# EAGLE design source_eagle (EAGLE 9.6.2)
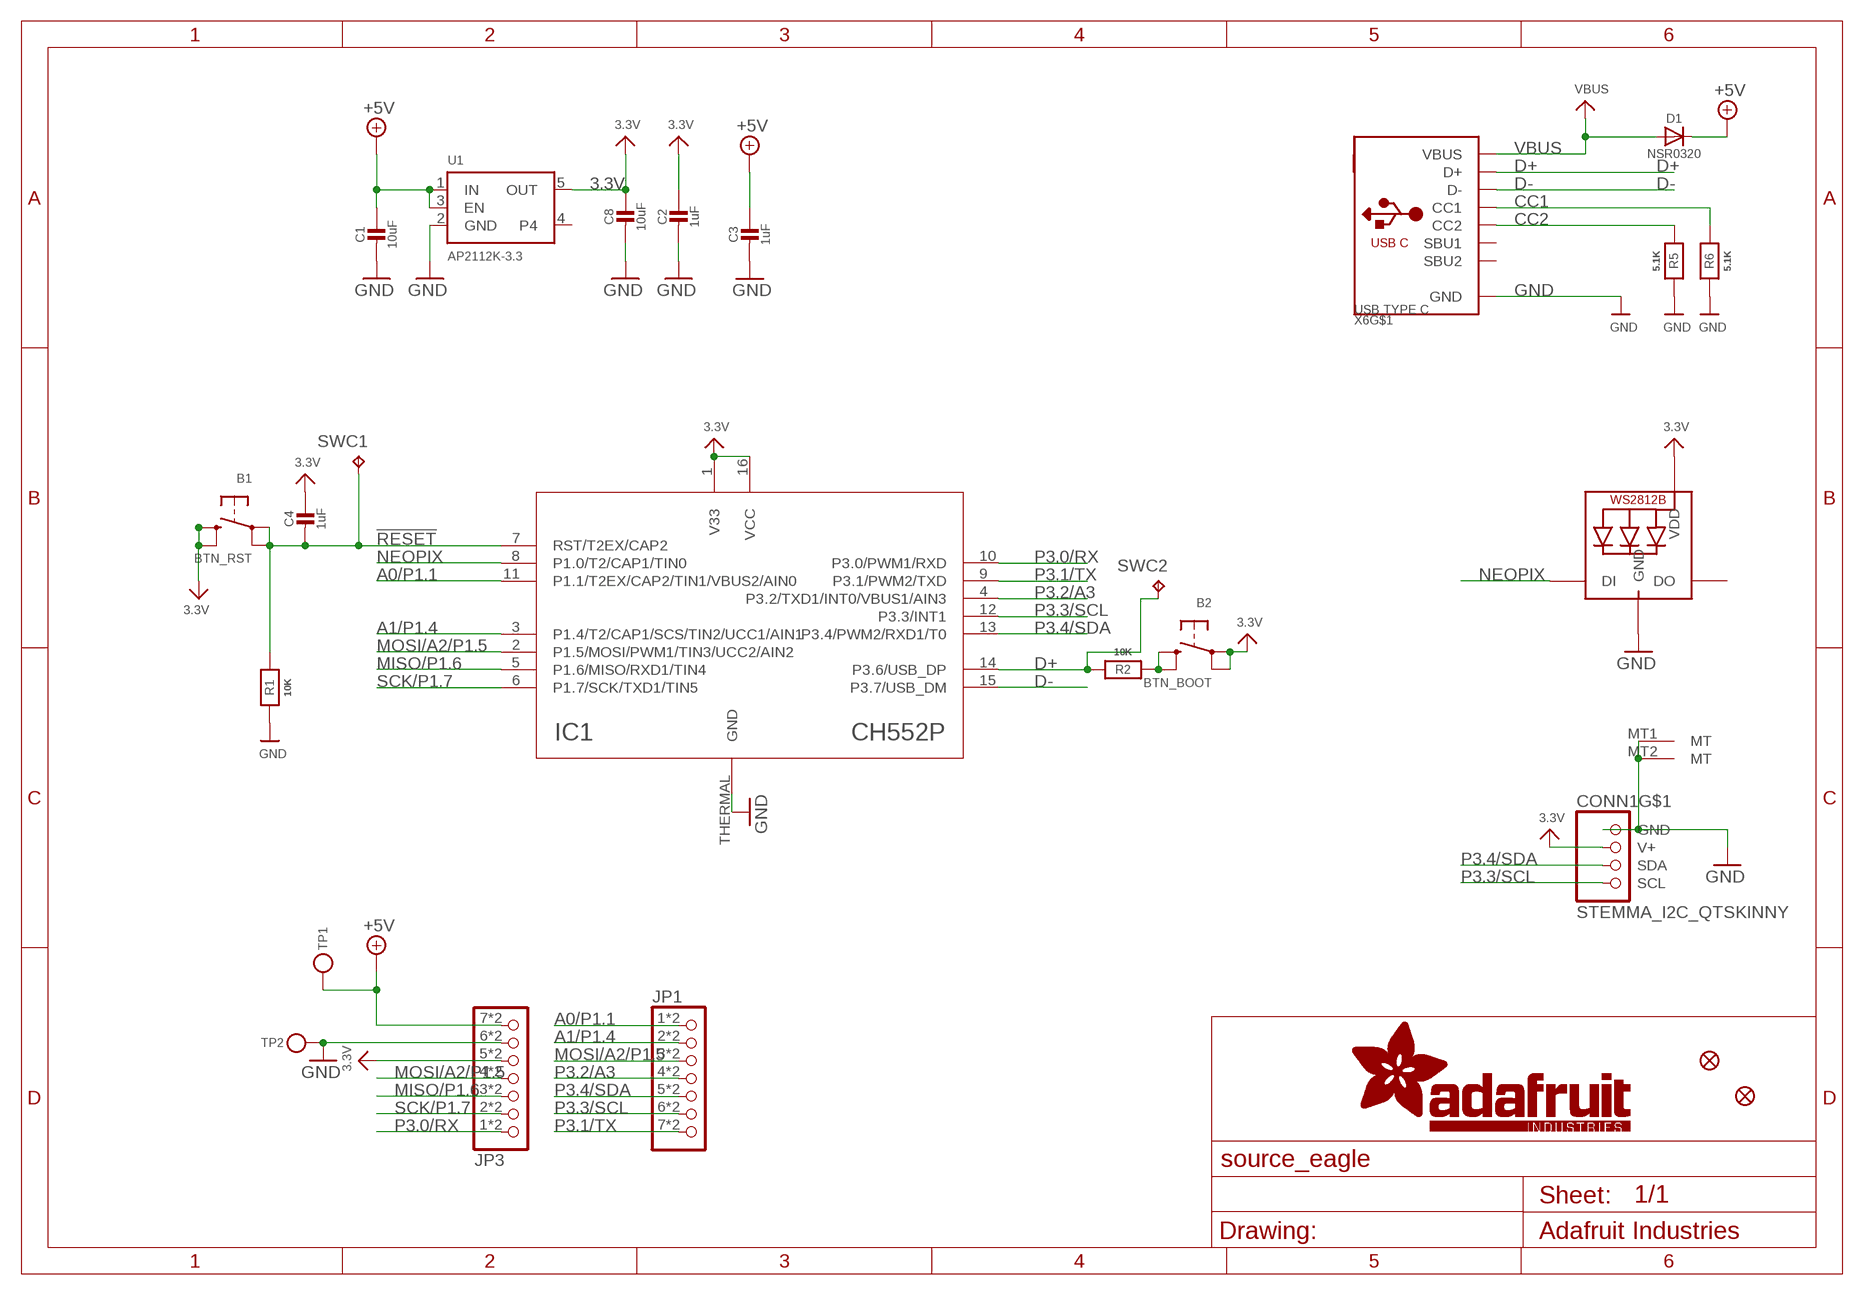
[diagram p0: schematic, sheet 1]

## Parts
B1  BTN_RST  SWITCH_TACT_SMT_RKB2  [BTN_RKB2_4.6X2.8]
B2  BTN_BOOT  SWITCH_TACT_SMT_RKB2  [BTN_RKB2_4.6X2.8]
C1  10uF  CAP_CERAMIC_0805MP  [_0805MP]
C2  1uF  CAP_CERAMIC_0402NO  [_0402NO]
C3  1uF  CAP_CERAMIC_0402NO  [_0402NO]
C4  1uF  CAP_CERAMIC_0402NO  [_0402NO]
C8  10uF  CAP_CERAMIC_0805MP  [_0805MP]
CONN1  STEMMA_I2C_QTSKINNY  [JST_SH4_SKINNY]
D1  NSR0320  DIODE_SOD323MINI  [SOD-323_MINI]
IC1  CH552PP  [QFN16_3MM]
JP1  HEADER-1X7_CASTEL  [1X07_CASTEL]
JP3  HEADER-1X7_CASTEL  [1X07_CASTEL]
LED1  WS2812B_SK6805_1515  [SK6805_1515]
R1  10K  RESISTOR_0402NO  [_0402NO]
R2  10K  RESISTOR_0402NO  [_0402NO]
R5  5.1K  RESISTOR_0402NO  [_0402NO]
R6  5.1K  RESISTOR_0402NO  [_0402NO]
SWC1  TPB1,27  [B1,27]
SWC2  TPTP15R  [TP15R]
TP1  TESTPOINT_PLUS13  [TESTPOINT_PLUS_1X3MM]
TP2  TESTPOINT_MINUS  [TESTPOINT_MINUS_1X3MM]
U1  AP2112K-3.3  VREG_SOT23-5  [SOT23-5]
U$6  FIDUCIAL_1MM  [FIDUCIAL_1MM]
U$8  FIDUCIAL_1MM  [FIDUCIAL_1MM]
X6  USB TYPE C  USB_C  [USB_C_CUSB31-CFM2AX-01-X]

## Nets
3.3V [power]: B1.B'(S1) B1.B(S) B2.A'(P1) B2.A(P) C2.1 C4.1 C8.1 CONN1.2(V+) IC1.1(V33) IC1.16(VCC) JP3.5 JP3.5C LED1.2(VDD) U1.5(OUT)
!RESET: B1.A'(P1) B1.A(P) C4.2 IC1.7(RST/T2EX/CAP2) R1.2 SWC1.TP
+5V [power]: C1.1 C3.1 D1.C JP3.7 JP3.7C TP1.P$1 U1.1(IN) U1.3(EN)
A0/P1.1: IC1.11(P1.1/T2EX/CAP2/TIN1/VBUS2/AIN0) JP1.1 JP1.1C
A1/P1.4: IC1.3(P1.4/T2/CAP1/SCS/TIN2/UCC1/AIN1) JP1.2 JP1.2C
CC1: R6.2 X6.A5(CC1)
CC2: R5.2 X6.B5(CC2)
D+: IC1.14(P3.6/USB_DP) R2.2 SWC2.TP X6.A6(D+) X6.B6(D+)
D-: IC1.15(P3.7/USB_DM) X6.A7(D-) X6.B7(D-)
GND [power]: C1.2 C2.2 C3.2 C8.2 CONN1.1(GND) CONN1.MT1(MT) CONN1.MT2(MT) IC1.THERMAL(GND) JP3.6 JP3.6C LED1.4(GND) R1.1 R5.1 R6.1 TP2.P$1 U1.2(GND) X6.A1B12(GND) X6.B1A12(GND)
MISO/P1.6: IC1.5(P1.6/MISO/RXD1/TIN4) JP3.3 JP3.3C
MOSI/A2/P1.5: IC1.2(P1.5/MOSI/PWM1/TIN3/UCC2/AIN2) JP1.3 JP1.3C JP3.4 JP3.4C
N$1: B2.B'(S1) B2.B(S) R2.1
NEOPIX: IC1.8(P1.0/T2/CAP1/TIN0) LED1.1(DI)
P3.0/RX: IC1.10(P3.0/PWM1/RXD) JP3.1 JP3.1C
P3.1/TX: IC1.9(P3.1/PWM2/TXD) JP1.7 JP1.7C
P3.2/A3: IC1.4(P3.2/TXD1/INT0/VBUS1/AIN3) JP1.4 JP1.4C
P3.3/SCL: CONN1.4(SCL) IC1.12(P3.3/INT1) JP1.6 JP1.6C
P3.4/SDA: CONN1.3(SDA) IC1.13(P3.4/PWM2/RXD1/T0) JP1.5 JP1.5C
SCK/P1.7: IC1.6(P1.7/SCK/TXD1/TIN5) JP3.2 JP3.2C
VBUS [power]: D1.A X6.A4B9(VBUS) X6.B4A9(VBUS)
Unconnected: LED1.3(DO) U1.4 X6.A8(SBU1) X6.B8(SBU2) X6.M1(MT) X6.M2(MT) X6.M3(MT) X6.M4(MT)

## Library data of the parts
B1 B2 = adafruit_electromech:SWITCH_TACT_SMT: SMT Tact Switches RKB2 https://www.digikey.com/short/m027prz5
C1-C4 C8 = microbuilder:CAP_CERAMIC: Ceramic Capacitors For new designs, use the packages preceded by an '_' character since they are more reliable: The following footprints should be used on most boards: _0402 - Standard footprint for regular board layouts _0603 - Standard footprint for regular board layouts _0805 - Standard footprint for regular board layouts _1206 - Standard footprint for regular board layouts For extremely tight-pitch boards where space is at a premium, the following 'micro-pitch' footprints can be used (smaller pads, no silkscreen outline, etc.): _0402MP - Micro-pitch footprint for very dense/compact boards _0603MP - Micro-pitch footprint for very dense/compact boards _0805MP - Micro-pitch footprint for very dense/compact boards _1206MP - Micro-pitch footprint for very dense/compact boards
CONN1 = microbuilder:STEMMA_I2C
D1 = microbuilder:DIODE: Diode SMA Model Volts Amps Type Vf Ir Digikey # Notes SSA34-E3 40V 3A Schottky 480mV @ 3A 200uA @ 40V SSA34-E3/61TGITR-ND CDBA120-G 20V 1A Schottky 500mV @ 1A 500uA @ 20V 641-1014-6-ND REEL MBRA210 10V 2A Schottky 350mV @ 2A 700uA @ 10V MBRA210LT3 SOD-123 Model Volts Amps Type Vf Ir Order # Notes BAT54T1G 30V 200mA Schottky 800mV @ 200mA 2uA @ 25V BAT54T1GOSTR-ND B0530W 30V 500mA Schottky 430mV @ 500mA 130uA @ 30V B0530W-FDICT-ND REEL MBR120 20V 1A Schottky 340mV @ 1A MBR120VLSFT1GOSCT-ND SOD-323 Model Volts Amps Type Vf Ir Order # Notes PMEG2005EJ 20V 500mA Schottky 355mV @ 500mA 568-4110-1-ND ZLLS410 10V 570mA Schottky 380mV @ 570mA ZLLS410CT-ND 1N4148WS 75V 150mA Silicon/Simple 1V 1N4148WSFSCT-ND REEL SOD-523 Model Volts Amps Type Vf Ir Order # Notes BAT54XV2 30V 200mA Schottky 0.8V @ 100mA BAT54XV2CT-ND TB751S 30V 30mA Schottky RB751S-40TE61CT-ND SOT23-R/W (R = Solder Paste/Reflow Ovens, W = Hand-Soldering) Model Volts Amps Type Vf Ir Order # Notes BAT54FILM 40V 300mA Schottky 497-7162-1-ND POWERDI-5 Model Volts Amps Type Vf Ir Order # Notes PDS560 60V 5A Schottky 670mV @ 5A 150uA @ 60V PDS560DICT-ND
IC1 = adafruit_micro:CH552P
JP1 JP3 = microbuilder:HEADER-1X7: PIN HEADER
LED1 = microbuilder:WS2812B; LCSC: C2890035
R1 R2 R5 R6 = microbuilder:RESISTOR: Resistors For new designs, use the packages preceded by an '_' character since they are more reliable: The following footprints should be used on most boards: _0402 - Standard footprint for regular board layouts _0603 - Standard footprint for regular board layouts _0805 - Standard footprint for regular board layouts _1206 - Standard footprint for regular board layouts For extremely tight-pitch boards where space is at a premium, the following 'micro-pitch' footprints can be used (smaller pads, no silkscreen outline, etc.): _0402MP - Micro-pitch footprint for very dense/compact boards _0603MP - Micro-pitch footprint for very dense/compact boards _0805MP - Micro-pitch footprint for very dense/compact boards _1206MP - Micro-pitch footprint for very dense/compact boards
SWC1 SWC2 = testpad:TP: Test pad
TP1 TP2 = microbuilder:TESTPOINT: Test Point Various test points for characterisation and PCB testing TESTPOINT_SMT - Compact Surface Mount Test Point [Digikey: 5016KTR-ND]
U1 = adafruit_power:VREG_SOT23-5: SOT23-5 Fixed Voltage Regulators Part Current Out V Out V In V Dropout θJA (°C/W) TJ (°C) Digikey Part No. ADP121 150mA 3.3V 3.4-5.5V 0.09V @ 150mA -- -- ADP121-AUJZ33R7CT-ND ADP121 150mA 3.0V 3.1-5.5V 0.09V @ 150mA -- -- ADP121-AUJZ30R7CT-ND ADP122 300mA 3.3V 3.4-5.5V 0.085V @ 300mA -- -- ADP122AUJZ-3.3-R7CT-ND ADP1712 300mA 3.3V 3.5-5.5V 0.17V @ 300mA -- -- ADP1712AUJZ-3.3-R7TR-ND AP7311 (Low Cost) 150mA 3.3V 3.5-6V 0.15V @ 150mA -- -- AP7311-33WG-7DICT-ND LD39015M18R 150mA 1.8V 1.9V-5.5V 0.08V @ 100mA -- -- 497-6977-1-ND LP2985A-33DBVR 150mA 3.3V 3.3-16V 0.28V @ 150mA 206 150 296-18479-1-ND MCP1824T-3302E/OT 300mA 3.3V 3.5V-6V 0.2V @ 300mA -- -- MCP1824T-3302E/OTCT-ND MIC5205-2.5YM5 TR 150mA 2.5V 2.7-16V 0.165V @ 150mA -- -- 576-1257-2-ND MIC5205-3.0YM5 TR 150mA 3.0V 3.2V-16V 0.165V @ 150mA -- -- 576-1258-2-ND MIC5205-3.3YM5 TR 150mA 3.3V 3.5V-16V 0.165V @ 150mA -- -- 576-1259-2-ND TPS780330220 150mA 3.3V+2.2V 3.6-5.5V 250mV Max -- -- 296-23332-1-ND TDA3663/N1,135 100mA 3.3V 3.5-45V 0.18V @ 50mA -- -- 568-5343-1-ND Max operating temp can be calculated using θJA, TJ (max junction temperature), and power in watts. Set the "Maximum Ambient Temperature" until it reaches TJ ("Max Junction Temperature"), which is the absolute limit for safe use of the regulator: Heat Sink Temperature Calculator <http://www.daycounter.com/Calculators/Heat-Sink-Temperature-Calculator.phtml> For example, With 12V source into a 3.3V LP2985 and a 30mA load, we are dissipating (12V-3.3V) * 0.03A = 0.261W. With a θJA of 206 °C/W, a TJ of 150°C, and 261mW we can safely use the chip without a heat sink up to 75°C (=147.1°C Junction Temperature).; JLC_ROTATION: 270
U$6 U$8 = microbuilder:FIDUCIAL: Fiducial Alignment Points Various fiducial points for machine vision alignment.; BOM: EXCLUDE
X6 = adafruit_electromech:USB_C: USB Type-C USB 2.0 Connector; LCSC: C165948

## Net classes
1 power: width 0.254 mm
2 gnd: width 0.254 mm

## Board
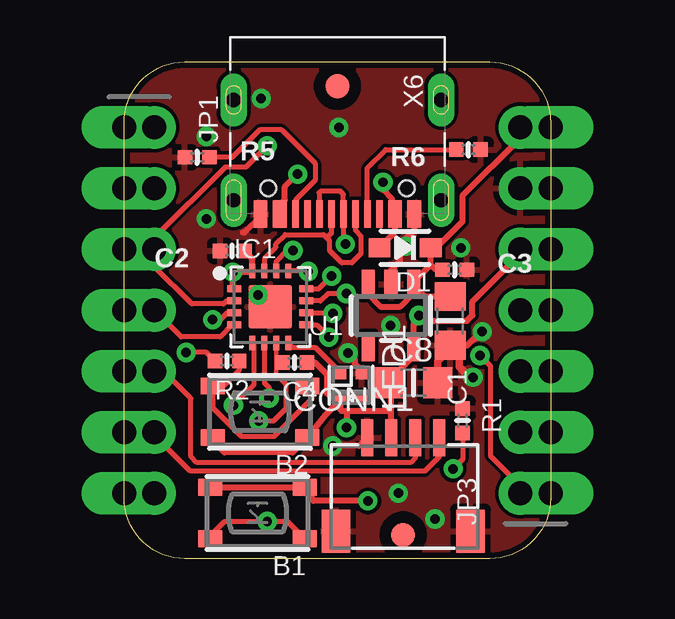
[diagram p1: board, top side]
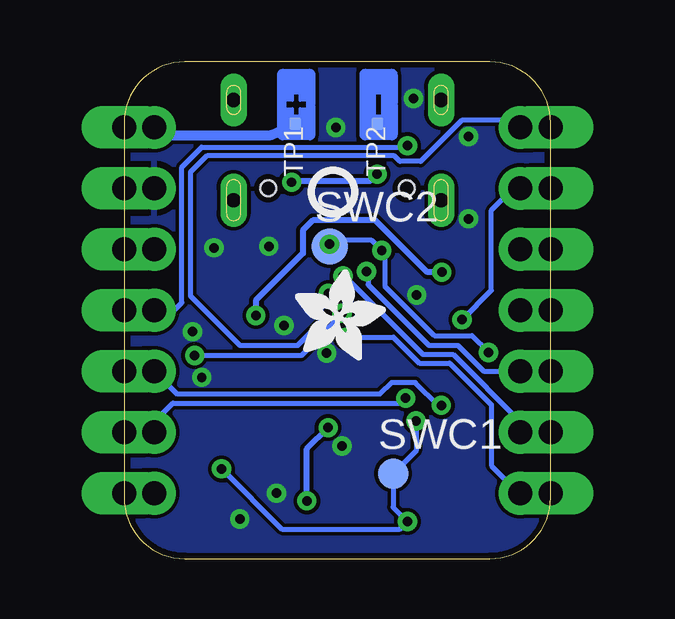
[diagram p2: board, bottom side, seen from below]

Size 17.78 x 20.7 mm. Coordinates in mm from the lower left corner, seen from the top.
Outline: 17.78,18.16 17.78,2.54 arc-90 15.24,0 2.54,0 arc-90 0,2.54 0,18.16 arc-90 2.54,20.7 15.24,20.7 arc-90 17.78,18.16
Copper layers (1*16): Top 0.035mm / dielectric 1.5mm / Bottom 0.035mm
Design rules "adafruit 6-6": minimum track width 6mil, minimum drill 15.5mil, track to track 6mil, track to pad 6mil, pad to pad 6mil, via to via 6mil, smd to smd 6mil, copper to edge 10mil, drill to drill 8mil, minimum pad ring 10mil, minimum via ring 8mil, stop-mask expansion 2mil, vias tented up to drill 20mil, thermal gap 10mil

### Footprints (pad centres in the part's own frame; a part is rotated, then mirrored left to right if it is on the bottom)
BTN_RKB2_4.6X2.8 = smd 1 x 0.7: A 1.973,1.075; A' -1.973,1.075; B 1.973,-1.075; B' -1.973,-1.075
_0805MP = smd 1.2 x 1.3: 1 -1.016,0; 2 1.016,0
_0402NO = smd 0.6 x 0.6: 1 -0.508,0; 2 0.508,0
JST_SH4_SKINNY = smd 0.5 x 1.55: 1 -1.5,2.514; 2 -0.5,2.514; 3 0.5,2.514; 4 1.5,2.514 | smd 1.2 x 1.8: MT1 -2.8,-1.386; MT2 2.8,-1.386
SOD-323_MINI = smd 0.9 x 0.8: A 1.07,0; C -1.07,0
QFN16_3MM = smd 0.6 x 0.28: 1 -1.5,0.75; 2 -1.5,0.25; 3 -1.5,-0.25; 4 -1.5,-0.75; 9 1.5,-0.75; 10 1.5,-0.25; 11 1.5,0.25; 12 1.5,0.75 | smd 0.28 x 0.6: 5 -0.75,-1.5; 6 -0.25,-1.5; 7 0.25,-1.5; 8 0.75,-1.5; 13 0.75,1.5; 14 0.25,1.5; 15 -0.25,1.5; 16 -0.75,1.5 | smd 1.8 x 1.8: THERMAL 0,0
1X07_CASTEL = drill 1 pad 1.778: 1 -7.62,0; 2 -5.08,0; 3 -2.54,0; 4 0,0; 5 2.54,0; 6 5.08,0; 7 7.62,0 | drill 1 pad 1.778 long: 1C -7.62,-1.27; 2C -5.08,-1.27; 3C -2.54,-1.27; 4C 0,-1.27; 5C 2.54,-1.27; 6C 5.08,-1.27; 7C 7.62,-1.27
SK6805_1515 = smd 0.5 x 0.5: 1 -0.5,-0.45; 2 0.5,-0.45; 3 0.5,0.45; 4 -0.5,0.45
B1,27 = smd 1.27 x 1.27: TP 0,0
TP15R = smd 1.5 x 1.5: TP 0,0
TESTPOINT_PLUS_1X3MM = smd 0.5 x 0.5: P$1 0.8,-0.05
TESTPOINT_MINUS_1X3MM = smd 0.5 x 0.5: P$1 0.8,-0.05
SOT23-5 = smd 0.55 x 1.2: 1 -0.95,-1.3; 2 0,-1.3; 3 0.95,-1.3; 4 0.95,1.3; 5 -0.95,1.3
FIDUCIAL_1MM = smd 1 x 1: 1 0,0
USB_C_CUSB31-CFM2AX-01-X = smd 0.575 x 1.15: A1B12 -3.2,2.275; A4B9 -2.4,2.275; B1A12 3.2,2.275; B4A9 2.4,2.275 | smd 0.275 x 1.15: A5 -1.25,2.275; A6 -0.25,2.275; A7 0.25,2.275; A8 1.25,2.275; B5 1.75,2.275; B6 0.75,2.275; B7 -0.75,2.275; B8 -1.75,2.275 | drill 0.6 pad 1 long: M1 -4.32,1.7; M2 4.32,1.7; M3 -4.32,-2.48; M4 4.32,-2.48 | hole 0.65: 2.89,1.2; -2.89,1.2

### Placement (x,y rotation side)
B1  5.56,1.91 180 top
B2  5.66,6.12 180 top
C1  13.59,9.91 270 top
C2  4.51,12.83 180 top
C3  13.78,12.04 0 top
C4  7.11,8.18 180 top
C8  12.05,7.33 0 top
CONN1  11.63,2.53 0 top
D1  11.71,12.95 180 top
IC1  6.1,10.49 0 top
JP1  1.27,10.35 270 top
JP3  16.51,10.35 90 top
LED1  9.46,7.23 270 top
PLABEL0  [PLABEL0]  15.49,10.29 0 bottom
PLABEL1  [PLABEL1]  15.49,7.87 0 bottom
PLABEL2  [PLABEL2]  14.86,4.06 90 bottom
PLABEL3  [PLABEL3]  14.86,1.52 90 bottom
PLABEL4  [PLABEL4]  2.92,1.52 90 bottom
PLABEL5  [PLABEL5]  2.92,4.06 90 bottom
PLABEL6  [PLABEL6]  5.21,7.87 0 bottom
PLABEL7  [PLABEL7]  5.21,10.41 0 bottom
PLABEL8  [PLABEL8]  5.21,12.83 0 bottom
PLABEL9  [PLABEL9]  2.92,14.35 90 bottom
PLABEL10  [PLABEL10]  2.79,16.89 90 bottom
PLABEL11  [PLABEL11]  14.99,17.53 90 bottom
PLABEL12  [PLABEL12]  14.99,13.72 90 bottom
PLABEL13  [PLABEL13]  15.37,12.7 0 bottom
PLABEL14  [PLABEL14]  9.02,6.73 0 bottom
R1  14.11,5.75 270 top
R2  4.29,8.24 180 top
R5  3.05,16.73 0 top
R6  14.35,17.04 180 top
SWC1  6.57,3.54 0 bottom
SWC2  9.21,13.02 0 bottom
TP1  10.6,18.92 270 bottom
TP2  7.18,18.92 270 bottom
U1  11.13,10.13 180 top
U$6  11.63,0.99 0 top
U$8  8.89,19.68 0 top
U$11  [ADAFRUIT_3.5MM]  10.67,8.26 0 bottom
U$12  [PCBFEAT-REV-040]  9.08,15.28 0 bottom
U$13  [QTPY_CH522_TOP]  0,0 0 top
U$21  [QTPY_CH552_BOT]  17.78,0 0 bottom
X6  8.89,16.64 180 top

### Tracks (layer width: path | path; a pad name or v marks a point on that pad's centre or on a via)
3.3V  (via drill 0.39)
  Top 0.254: 9.01,6.22 LED1.2 8.63,6.73 8.45,6.91 8.45,7.68 7.95,8.18 C4.1 | CONN1.2 11.13,6.16 | 11.13,6.16 11.13,7.27 C8.1 11.04,7.42 12.07,8.45 U1.5 12.07,9.81 | 12.07,9.81 12.17,9.91 14.28,9.91 14.52,10.14 14.52,10.71 16.51,12.7 JP3.5 JP3.5C | B1.B B1.B' 7.91,2.41 v10.16,2.41 | 9.01,6.22 8.82,6.41 8.41,6 B2.A' 7.02,4.43 4.18,4.43 3.69,4.92 B2.A | 9.01,6.22 9.07,6.16 9.27,6.16 | 9.27,6.16 11.13,6.16 | 9.27,6.16 v9.27,5.46 | v12.29,10.13 12.29,9.94 12.16,9.81 12.07,9.81 | IC1.1 4.54,11.3 v4.54,11.94 5.29,11.94 IC1.16 5.35,12.5 C2.1
  Bottom 0.254: v10.16,2.41 10.16,4.57 v9.27,5.46 | v4.54,11.94 5.14,11.94 7.3,14.1 9.91,14.1 10.32,13.68 10.32,12.72 12.29,10.76 v12.29,10.13
!RESET  (via drill 0.39)
  Top 0.178: 6.35,7.68 6.35,8.19 | 6.35,8.19 IC1.7 | C4.2 6.36,8.18 6.35,8.19
  Top 0.203: v5.61,5.74 6.24,5.74 6.74,6.24 6.74,7.29 6.35,7.68 | B1.A 3.59,0.96 4.18,1.55 v5.97,1.55 6.82,1.55 B1.A' | R1.2 14.11,4.14 v13.72,3.75
  Bottom 0.203: v5.61,5.74 5.61,4.5 SWC1.TP 6.57,2.15 v5.97,1.55 6.29,1.23 11.2,1.23 v13.72,3.75
+5V
  Top 0.254: U1.1 12.21,11.57 12.15,11.63 12.78,12.26 | 12.78,12.26 D1.C 13.01,12.95 14.1,14.05 14.1,15.11 16.51,17.53 JP3.7 JP3.7C | C1.1 12.54,10.92 12.07,11.38 U1.1 | U1.3 10.18,11.01 10.68,10.5 11.51,10.5 12.07,11.07 U1.1 | C3.1 12.99,12.04 12.78,12.26
  Bottom 0.406: JP3.7 16.19,17.65 11.66,17.65 TP1.P$1
A0/P1.1  (via drill 0.39)
  Top 0.203: v9.26,11.05 8.5,11.05 8.19,10.74 IC1.11
  Bottom 0.203: JP1.1 JP1.1C 1.33,17.97 1.65,18.29 3.68,18.29 5.42,16.55 6.28,16.55 6.52,16.79 14.33,16.79 15.01,16.11 15.01,10.95 12.95,8.89 10.53,8.89 9.58,9.84 9.58,10.73 v9.26,11.05
A1/P1.4  (via drill 0.39)
  Top 0.203: IC1.3 4.29,10.24 4.01,9.96 v3.7,9.96
  Bottom 0.203: v3.7,9.96 2.48,11.18 2.48,14.52 1.56,15.43 JP1.2 JP1.2C
CC1
  Top 0.203: X6.A5 10.14,16.29 10.9,17.04 R6.2
CC2
  Top 0.203: R5.2 4.51,16.73 5.65,17.87 6.57,17.87 7.96,16.47 7.96,15.76 7.14,14.93 X6.B5
D+  (via drill 0.39)
  Top 0.203: X6.B6 8.13,14.38 8.13,15.25 8.2,15.33 8.99,15.33 9.14,15.18 X6.A6 9.14,13.19 v9.22,13.11 | IC1.14 6.35,12.4 6.79,12.84 v7.04,12.84 | R2.2 3.44,8.59 v2.59,8.59
  Bottom 0.152: SWC2.TP 9.21,13.09 v9.22,13.11
  Bottom 0.203: v9.22,13.11 9.04,13.29 7.49,13.29 v7.04,12.84 6.91,12.72 6.91,11.36 4.84,9.29 3.29,9.29 v2.59,8.59
D-
  Top 0.203: X6.A7 8.64,13.56 8.45,13.37 | IC1.15 5.85,12.51 6.32,12.99 6.32,13.11 6.71,13.5 8.32,13.5 8.45,13.37 | 8.45,13.37 8.57,13.25 8.57,12.84 9.08,12.32 9.49,12.32 9.87,12.71 9.87,13.44 9.64,13.68 X6.B7
GND  (via drill 0.39)
  Top 0.254: v9.34,8.57 9.62,8.29 9.62,8.12 9.91,7.83 LED1.4 | X6.B1A12 5.69,14.27 5.01,13.59 4.96,13.59 | X6.A1B12 12.09,13.68 11.49,13.08 11.49,12.37 11.12,12.01 U1.2 | CONN1.1 9.79,4.7 v8.7,4.7 | C1.2 14.3,8.89 14.55,9.14 14.61,9.14 v14.92,9.46 | v14.54,7.56 14.41,7.56 14.35,7.62
  Top 0.305: C8.2 13.07,8.22 13.63,8.78 13.63,8.85 C1.2 13.59,8.76 13.97,8.38 13.97,8 14.35,7.62
  other vias: 5.59,10.99 3.43,17.59 3.43,14.16 8.95,17.97 12.95,1.65 11.43,2.73 5.71,19.18 11.75,13.02 14.03,12.95 11.11,9.72
  pour Top: 0,0 0,20.64 17.78,20.64 17.78,0
  pour Bottom: 0,0 0,20.64 17.78,20.64 17.78,0
MISO/P1.6  (via drill 0.39)
  Top 0.203: IC1.5 5.4,8.94 5.4,7.23 v4.56,6.39 | JP3.3C 17.06,7.81 17.02,7.85 16.55,7.85 JP3.3
  Bottom 0.203: JP3.3 15.56,6.86 7.12,6.86 6.63,7.34 5.64,7.34 4.69,6.39 v4.56,6.39
MOSI/A2/P1.5  (via drill 0.39)
  Top 0.203: IC1.2 4.28,10.74 4.15,10.61 2.82,10.61 1.27,12.17 JP1.3 1.27,13.37 4.22,16.32 5.08,16.32 v5.97,17.21 | JP3.4C JP3.4
  Bottom 0.203: JP1.3C JP1.3 | JP3.4C 15.68,10.35 15.37,10.67 15.37,16.32 14.54,17.14 6.03,17.14 v5.97,17.21
N$1
  Top 0.203: R2.1 4.8,7.85 3.93,6.98 B2.B 3.69,6.29 4.9,5.09 6.24,5.09 7.83,6.68 7.76,7.2 B2.B'
NEOPIX
  Top 0.203: IC1.8 7.04,8.8 7.99,8.8 9.01,7.78 LED1.1
P3.0/RX  (via drill 0.39)
  Top 0.203: IC1.10 8.68,10.24 v8.7,10.22 | v14.83,8.46 15.27,8.03 15.27,4.29 16.51,3.05 JP3.1
  Top 0.254: JP3.1C JP3.1
  Bottom 0.203: v8.7,10.22 8.7,10.16 10.39,8.46 v14.83,8.46
P3.1/TX  (via drill 0.39)
  Top 0.203: IC1.9 8.03,9.74 v8.53,9.23
  Bottom 0.203: JP1.7C JP1.7 1.33,2.73 2.48,3.87 2.48,6.42 4.21,8.15 5.48,8.15 6.55,9.23 v8.53,9.23
P3.2/A3
  Top 0.203: IC1.4 4.5,9.74 4,9.25 2.38,9.25 JP1.4
  Bottom 0.203: JP1.4C JP1.4
P3.3/SCL  (via drill 0.39)
  Top 0.203: IC1.12 8.1,11.24 v8.65,11.78 | CONN1.4 13.13,4.24 12.54,3.65 2.77,3.65 1.27,5.14 JP1.6
  Bottom 0.203: v8.65,11.78 8.6,11.78 5.33,8.51 4.06,8.51 1.27,5.71 JP1.6 JP1.6C
P3.4/SDA  (via drill 0.39)
  Top 0.203: v7.67,11.96 7.65,11.99 IC1.13 | CONN1.3 12.13,4.2 11.94,4 3.04,4 2.78,4.26 2.78,6.68 1.65,7.81 JP1.5
  Bottom 0.203: v7.67,11.96 7.64,11.99 7.61,11.96 7.61,11.42 5.08,8.89 3.87,8.89 2.79,7.81 JP1.5 JP1.5C
SCK/P1.7  (via drill 0.39)
  Top 0.203: IC1.6 5.85,7.33 6.04,7.13 v6.04,6.69
  Top 0.254: JP3.2C JP3.2
  Bottom 0.203: v6.04,6.69 6.25,6.48 15.74,6.48 16.51,5.71 JP3.2
VBUS  (via drill 0.39)
  Top 0.254: D1.A 11.29,13.61 X6.A4B9 11.16,14.49 11.16,15 10.79,15.37 v10.79,15.68 | X6.B4A9 6.56,14.43 6.56,14.81 6.71,14.95 6.71,15.5 v7.23,16.02
  Bottom 0.254: v7.23,16.02 7.5,15.75 10.72,15.75 v10.79,15.68

### Text on the board
Pinguin_bBackup: 5V | 1.1 | 1.4 | GND | P1.5 | 3V | P3.2 | P1.5 | P3.4 | P1.6 | CH552 | 3.3 | 1.7 | 3.1 | 3.0